# Altium schematic sheet 计算机原理课程设计.SchDoc: 计算机原理实验课程设计
size A0; Date: 2017/12/25; Organization: DLUT; DocumentNumber: 1; Revision: 1; SheetNumber: 1; SheetTotal: 1; CurrentTime: 10:26; DocumentFullPathAndName: E:\WorkSpace\计算机原理\计算机原理实验课程设计.ShcDoc; DocumentName: 计算机原理实验课程设计.ShcDoc
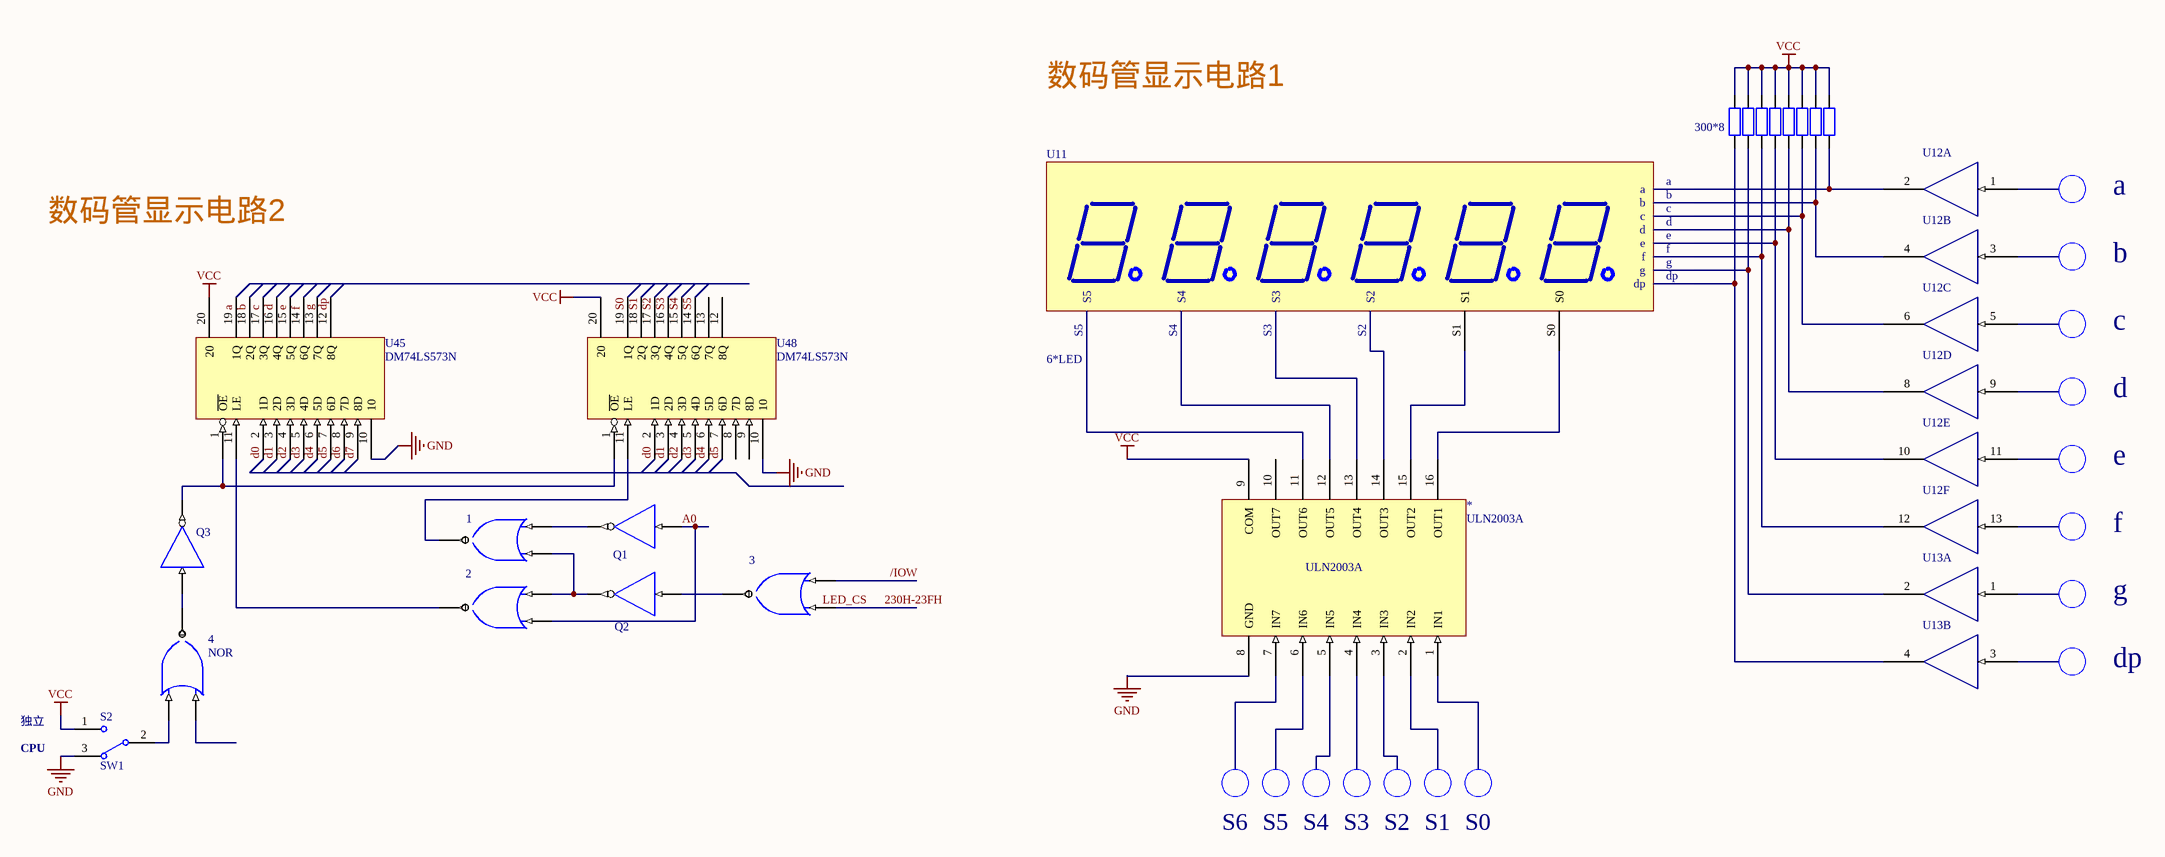
[diagram p0: 计算机原理课程设计.SchDoc]

## Parts
1  (no value)
2  (no value)
3  (no value)
4  NOR
*  ULN2003A
Q1  NOT  (value not drawn)
Q2  NOT  (value not drawn)
Q3  NOT  (value not drawn)
R10  value 300*8  [AXIAL-0.4]  (hidden comment: Res2)
R11  Res2  [AXIAL-0.4]  (value not drawn)
R12  Res2  [AXIAL-0.4]  (value not drawn)
R13  Res2  [AXIAL-0.4]  (value not drawn)
R14  Res2  [AXIAL-0.4]  (value not drawn)
R15  Res2  [AXIAL-0.4]  (value not drawn)
R16  Res2  [AXIAL-0.4]  (value not drawn)
R17  Res2  [AXIAL-0.4]  (value not drawn)
S2  SW1  [TL36WW15050]
U11  6*LED
U12  SN74LS07D  (value not drawn)  (parts A,B,C,D,E,F of 6)
U13  SN74LS07D  (value not drawn)  (parts A,B of 6)
U45  DM74LS573N  [DIP-20]
U48  DM74LS573N  [DIP-20]

## Nets
GND: *.8(GND) S2.3 U45.10(GND) U48.10(GND)
VCC: *.9(COM) R10.2 R11.2 R12.2 R13.2 R14.2 R15.2 R16.2 R17.2 S2.1 U45.20(VCC) U48.20(VCC)
230H-23FH: 3.1(A)
/IOW: 3.2(B)
A0: 2.1(A) Q1.1(A)
d0: U45.2(1D) U48.2(1D)
d1: U45.3(2D) U48.3(2D)
d2: U45.4(3D) U48.4(3D)
d3: U45.5(4D) U48.5(4D)
d4: U45.6(5D) U48.6(5D)
d5: U45.7(6D) U48.7(6D)
d6: U45.8(7D)
d7: U45.9(8D)
Net1_1: 1.1(A) 2.2(B) Q2.2(Y)
Net1_2: 1.2(B) Q1.2(Y)
Net1_3: 1.3(Y) U48.11(LE)
Net2_3: 2.3(Y) U45.11(LE)
Net3_3: 3.3(Y) Q2.1(A)
Net4_1: 4.1(A) S2.2
Net4_3: 4.3(Y) Q3.1(A)
Net*_11: *.11(OUT6) U11.S5
Net*_12: *.12(OUT5) U11.S4
Net*_13: *.13(OUT4) U11.S3
Net*_14: *.14(OUT3) U11.S2
Net*_15: *.15(OUT2) U11.S1
Net*_16: *.16(OUT1) U11.S0
NetQ3_2: Q3.2(Y) U45.1(~{OE}) U48.1(~{OE})
NetR10_1: R10.1 U11.dp U13.4
NetR11_1: R11.1 U11.g U13.2
NetR12_1: R12.1 U11.f U12.12
NetR13_1: R13.1 U11.e U12.10
NetR14_1: R14.1 U11.d U12.8
NetR15_1: R15.1 U11.c U12.6
NetR16_1: R16.1 U11.b U12.4
NetR17_1: R17.1 U11.a U12.2

Not connected (* = marked no-connect by the designer): 4 2(B); * 1(IN1) 2(IN2) 3(IN3) 4(IN4) 5(IN5) 6(IN6) 7(IN7) 10(OUT7); U12 1 3 5 9 11 13; U13 1 3; U45 12(8Q) 13(7Q) 14(6Q) 15(5Q) 16(4Q) 17(3Q) 18(2Q) 19(1Q); U48 8(7D) 9(8D) 12(8Q) 13(7Q) 14(6Q) 15(5Q) 16(4Q) 17(3Q) 18(2Q) 19(1Q)

## Notes on the sheet
- 数码管显示电路1
- 数码管显示电路2
- a
- b
- c
- d
- e
- f
- g
- 独立
- dp
- CPU
- S6
- S5
- S4
- S3
- S2
- S1
- S0
- Labels drawn without touching a wire or pin: a, b, c, d, dp, e, f, g, LED_CS, S0, S1, S2, S3, S4, S5
- Title
- Size:
- Date:
- A4
- Number:
- Time:
- Revision:
- Sheet
- of
- File:

## Library data of the parts
1-3 = NOR
Q1-Q3 = NOT: Inverter
R10 = Res2: Resistor; Published: 8-Jun-2000; LatestRevisionDate: 17-Jul-2002; LatestRevisionNote: Re-released for DXP Platform.; PackageReference: AXIAL-0.4; Publisher: Altium Limited; PackageDescription: Axial Device, Thru-Hole; 2 Leads; 0.4 in Pin Spacing
R11-R17 = Res2: Resistor; Value: 300; Published: 8-Jun-2000; LatestRevisionDate: 17-Jul-2002; LatestRevisionNote: Re-released for DXP Platform.; PackageReference: AXIAL-0.4; Publisher: Altium Limited; PackageDescription: Axial Device, Thru-Hole; 2 Leads; 0.4 in Pin Spacing
S2 = SW-SPDT: SPDT Subminiature Toggle Switch, Right Angle Mounting, Vertical Actuation; Published: 24-Mar-1999; LatestRevisionDate: 17-Dec-2003; LatestRevisionNote: Schematic revised, PCB Footprint replaced.; DatasheetVersion: 05-Dec-2000; PackageReference: TL36WW15050; Publisher: Altium Limited; PackageDescription: Switch; 4 Leads; ComponentLink1Description: Manufacturer Link; ComponentLink1URL: http://www.apem.com
U45 = SN74HC573: OCTAL D-TYPE TRANSPARENT LCH 3SO
U48 = SN74HCT573: OCTAL D-TYPE TRANSPARENT LCH 3SO